# Altium schematic sheet ESP32CTRL_AD_SCH.schdoc
size 243 x 171 mm
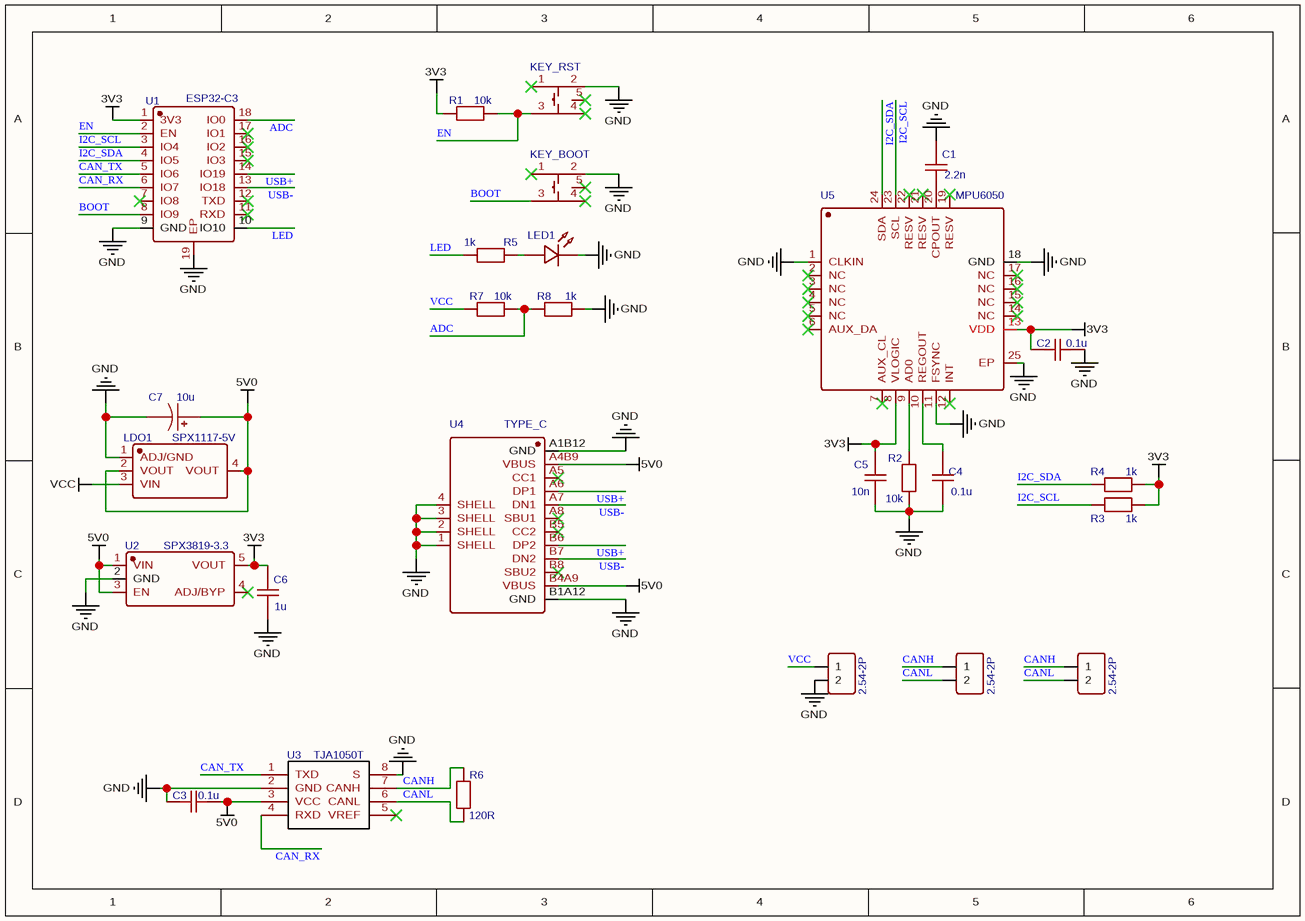
[diagram p0: ESP32CTRL_AD_SCH.schdoc]

## Parts
C1  2.2n  [C0603]
C2  0.1u  [C0603]
C3  0.1u  [C0603]
C4  0.1u  [C0603]
C5  10n  [C0603]
C6  1u  [C0603]
C7  10u  [CASE-A_3216]
J1  2.54-2P  [HDR-M-2.54_1X2]
J3  2.54-2P  [HDR-M-2.54_1X2]
J4  2.54-2P  [HDR-M-2.54_1X2]
KEY_BOOT  YTSA007A0152501B  [SW-SMD_4P-L3.4-W3.4-P2.00-LS4.0_TS3315A160GF]  (value not drawn)
KEY_RST  YTSA007A0152501B  [SW-SMD_4P-L3.4-W3.4-P2.00-LS4.0_TS3315A160GF]  (value not drawn)
LDO1  SPX1117-5V  [SOT-223-4_L6.5-W3.5-P2.30-LS7.0-BR]
LED1  LED-0603_R  [LED0603_RED]  (value not drawn)
R1  10k  [R0603]
R2  10k  [R0603]
R3  1k  [R0603]
R4  1k  [R0603]
R5  1k  [R0603]
R6  120R  [R0603]
R7  10k  [R0603]
R8  1k  [R0603]
U1  ESP32-C3  [BULETM-SMD_18P-L20.0-W18.0-P1.50_ESP32-C3-WROOM]
U2  SPX3819-3.3  [SOT-23-5_L2.9-W1.6-P0.95-LS2.8-BL]
U3  TJA1050T  [SOIC-8_L5.0-W4.0-P1.27-LS6.0-BL]
U4  TYPE_C  [USB-C-SMD_TYPE-C16PIN-SHOUHAN]
U5  MPU6050  [QFN-24_L4.0-W4.0-P0.50-BL-EP2.7]

## Nets
3V3: C2.1 C5.2 C6.2 R1.1 R3.2 R4.2 U1.1(3V3) U2.5(VOUT) U5.8(VLOGIC) U5.13(VDD)
5V0: C3.2 C7.1 LDO1.2(VOUT) LDO1.4(VOUT) U2.1(VIN) U2.3(EN) U3.3(VCC) U4.A4B9(VBUS) U4.B4A9(VBUS)
GND: C1.2 C2.2 C3.1 C4.1 C5.1 C6.1 C7.2 J1.2 KEY_BOOT.2 KEY_RST.2 LDO1.1(ADJ/GND) LED1.2 R2.1 R8.1 U1.9(GND) U1.19(EP) U2.2(GND) U3.2(GND) U3.8(S) U4.1(SHELL) U4.2(SHELL) U4.3(SHELL) U4.4(SHELL) U4.A1B12(GND) U4.B1A12(GND) U5.1(CLKIN) U5.11(FSYNC) U5.18(GND) U5.25(EP)
VCC: J1.1 LDO1.3(VIN) R7.1
ADC: R7.2 R8.2 U1.18(IO0)
BOOT: KEY_BOOT.3 U1.8(IO9)
CAN_RX: U1.6(IO7) U3.4(RXD)
CAN_TX: U1.5(IO6) U3.1(TXD)
CANH: J3.1 J4.1 R6.2 U3.7(CANH)
CANL: J3.2 J4.2 R6.1 U3.6(CANL)
EN: KEY_RST.3 R1.2 U1.2(EN)
I2C_SCL: R3.1 U1.3(IO4) U5.23(SCL)
I2C_SDA: R4.1 U1.4(IO5) U5.24(SDA)
LED: R5.2 U1.10(IO10)
USB+: U1.14(IO19) U4.A6(DP1) U4.B6(DP2)
USB-: U1.13(IO18) U4.A7(DN1) U4.B7(DN2)
NetC1_1: C1.1 U5.20(CPOUT)
NetC4_2: C4.2 U5.10(REGOUT)
NetLED1_1: LED1.1 R5.1
NetR2_2: R2.2 U5.9(AD0)

Not connected (* = marked no-connect by the designer): KEY_BOOT 1* 4* 5*; KEY_RST 1* 4* 5*; U1 7(IO8)* 11(RXD)* 12(TXD)* 15(IO3)* 16(IO2)* 17(IO1)*; U2 4(ADJ/BYP)*; U3 5(VREF)*; U4 A5(CC1)* A8(SBU1)* B5(CC2)* B8(SBU2)*; U5 2(NC)* 3(NC)* 4(NC)* 5(NC)* 6(AUX_DA)* 7(AUX_CL)* 12(INT)* 14(NC)* 15(NC)* 16(NC)* 17(NC)* 19(RESV)* 21(RESV)* 22(RESV)*

## Library data of the parts
C1 = 2.2n: nameAlias: Value(F); Contributor: LCEDA_Lib; spicePre: C; spiceSymbolName: C_0603_US
C2-C4 = 0.1u: nameAlias: Value(F); Contributor: LCEDA_Lib; spicePre: C; spiceSymbolName: C_0603_US
C5 = 10n: nameAlias: Value(F); Contributor: LCEDA_Lib; spicePre: C; spiceSymbolName: C_0603_US
C6 = 1u: nameAlias: Value(F); Contributor: LCEDA_Lib; spicePre: C; spiceSymbolName: C_0603_US
C7 = 10u: nameAlias: Value(F); Contributor: LCEDA_Lib; spicePre: C; spiceSymbolName: C_Tan_SMD_A_US
J1 J3 J4 = 2.54-2P: Contributor: LCEDA_Lib; BOM_Supplier Part: C124375; BOM_Supplier: LCSC; spicePre: J; spiceSymbolName: HDR-M-2.54_1x2
KEY_BOOT KEY_RST = YTSA007A0152501B: BOM_Manufacturer: DGBZ; Contributor: LCSC; BOM_Supplier: LCSC; BOM_Supplier Part: C967768; BOM_Manufacturer Part: YTSA007A0152501B; BOM_JLCPCB Part Class: Extended Part; spicePre: S; spiceSymbolName: YTSA007A0152501B
LDO1 = SPX1117-5V: BOM_Manufacturer: MaxLinear; BOM_Manufacturer Part: SPX1117M3-L/TR; BOM_Supplier: LCSC; BOM_Supplier Part: C67402; BOM_JLCPCB Part Class: Extended Part; spicePre: L; spiceSymbolName: SPX1117M3-L/TR
LED1 = LED-0603_R: BOM_Manufacturer: EVERLIGHT(台湾亿光); BOM_Manufacturer Part: 19-217/R6C-AL1M2VY/3T; Contributor: LCEDA_01; BOM_Supplier Part: C72044; BOM_Supplier: LCSC; spicePre: L; spiceSymbolName: LED-0603_R
R1 R2 R7 = 10k: nameAlias: Value(Ω); Contributor: LCEDA_Lib; spicePre: R; spiceSymbolName: R_0603_EU
R3-R5 R8 = 1k: nameAlias: Value(Ω); Contributor: LCEDA_Lib; spicePre: R; spiceSymbolName: R_0603_EU
R6 = 120R: nameAlias: Value(Ω); Contributor: LCEDA_Lib; spicePre: R; spiceSymbolName: R_0603_EU
U1 = ESP32-C3: BOM_Manufacturer Part: ESP32-C3-WROOM-02-N4; BOM_Manufacturer: null; Contributor: LCSC; BOM_Supplier: LCSC; BOM_Supplier Part: C9900000362; BOM_JLCPCB Part Class: Extended Part; link: https://img.jlc.com//pdf/applyPasteComponent/2021-09-22/691768A/573e676df3ac4789afe05c8f8f79425b/esp32-c3-wroom-02_datasheet_cn.pdf; spicePre: U; spiceSymbolName: ESP32-C3-WROOM-02-N4
U2 = SPX3819-3.3: BOM_Manufacturer: null; BOM_Manufacturer Part: SPX3819M5-3.3; Contributor: lcsc; BOM_Supplier: LCSC; BOM_Supplier Part: C9900018941; BOM_JLCPCB Part Class: Extended Part; spicePre: U; spiceSymbolName: SPX3819M5-3.3
U3 = TJA1050T: BOM_Manufacturer: NXP(恩智浦); BOM_Manufacturer Part: TJA1050T/CM,118; BOM_Supplier: LCSC; BOM_Supplier Part: C6952; BOM_JLCPCB Part Class: Basic Part; spicePre: U; spiceSymbolName: TJA1050T/CM,118
U4 = TYPE_C: BOM_Manufacturer: null; BOM_Manufacturer Part: TYPE_16/20; Contributor: lcsc; BOM_Supplier: LCSC; BOM_Supplier Part: C9900017551; BOM_JLCPCB Part Class: Extended Part; spicePre: U; spiceSymbolName: TYPE_16/20
U5 = MPU6050: BOM_Manufacturer: null; BOM_Manufacturer Part: MPU6050-YJLTY; Contributor: LCSC; BOM_Supplier: LCSC; BOM_Supplier Part: C2912107; BOM_JLCPCB Part Class: Extended Part; spicePre: U; spiceSymbolName: MPU6050-YJLTY